# Altium project pay-ssm.PrjPCB (part 2 of 2)
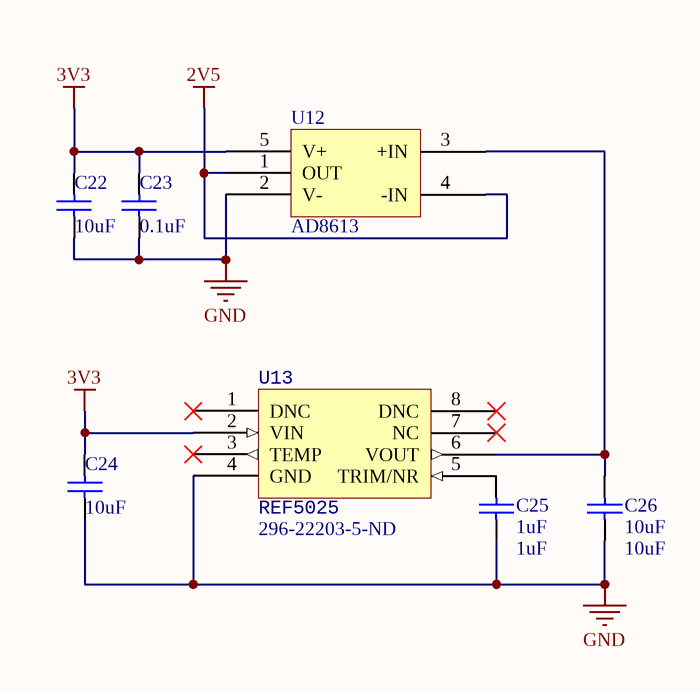
[diagram p13: power2V5.SchDoc]

## Nets that join several sheets
2V5: pay-ssm (10 pins), thermistorADC (C32.2 U17.31), power2V5 (U12.1 U12.4)
3V3: pay-ssm (5 pins), ATmega32M1 (14 pins), can_transciever (C9.2 C10.2 U4.3), sensors (9 pins), heater_control (6 pins), dac-layout (5 pins), MC2 (R20_MC2.2 R23_MC2.2), portExpander (7 pins), MC1 (R20_MC1.2 R23_MC1.2), positioningAndThermistor (C20.2 C21.2 U10.5 U11.5), thermistorADC (9 pins), sensors-digital (9 pins), microcontrollerOptical (16 pins), power2V5 (5 pins)
+5: pay-ssm (P2.4 P21.15), heater_control (11 pins), MC2 (C16_MC2.2 C17_MC2.2 U8_MC2.18 U8_MC2.19), MC1 (C16_MC1.2 C17_MC1.2 U8_MC1.18 U8_MC1.19)
GND: pay-ssm (5 pins), ATmega32M1 (13 pins), can_transciever (6 pins), sensors (8 pins), heater_control (9 pins), dac-layout (5 pins), MC2 (15 pins), portExpander (8 pins), MC1 (15 pins), positioningAndThermistor (18 pins), thermistorADC (16 pins), sensors-digital (11 pins), microcontrollerOptical (13 pins), power2V5 (7 pins)
ADC_~{CS}: ATmega32M1 (U2.27), thermistorADC (R49.1 U17.23)
CANH: pay-ssm (P2.3 P21.2), can_transciever (R15.1 U4.7)
CANL: pay-ssm (P2.2 P21.4), can_transciever (R12.1 U4.6)
CH2: pay-ssm (P3.6), positioningAndThermistor (R41.6), thermistorADC (U17.16)
CH3: pay-ssm (P3.8), positioningAndThermistor (R41.5), thermistorADC (U17.15)
CH4: pay-ssm (P3.10), positioningAndThermistor (R42.8), thermistorADC (U17.14)
CH6: pay-ssm (P4.6), positioningAndThermistor (R42.5), thermistorADC (U17.12)
CH7: pay-ssm (P4.4), positioningAndThermistor (R42.6), thermistorADC (U17.11)
CH8: pay-ssm (P4.8), positioningAndThermistor (R43.6), thermistorADC (U17.10)
CH9: pay-ssm (P4.10), positioningAndThermistor (R43.5), thermistorADC (U17.9)
CH10: positioningAndThermistor (U11.1 U11.4), thermistorADC (U17.8)
CH11: positioningAndThermistor (U10.1 U10.4), thermistorADC (U17.7)
DAC_A: pay-ssm (P21.12), heater_control (U5.4 U6.4), dac-layout (U19#1.1)
DAC_B: pay-ssm (P21.14), heater_control (U7.4), dac-layout (U19#1.2)
DAC_~{CLR}: ATmega32M1 (U2.32), dac-layout (R47.1 U19#1.5)
DAC_~{CS}: ATmega32M1 (U2.29), dac-layout (R46.1 U19#1.6)
DATA_RDY: ATmega32M1 (U2.16), sensors-digital (R53.2), microcontrollerOptical (U20.29)
DECAY: MC2 (R30_MC2.2 U8_MC2.3), portExpander (U9.23), MC1 (R30_MC1.2 U8_MC1.3)
DIR_A: portExpander (U9.24), MC1 (U8_MC1.12)
DIR_B: MC2 (U8_MC2.12), portExpander (U9.4)
~{EN}_A: portExpander (U9.26), MC1 (R23_MC1.1 U8_MC1.10)
~{EN}_B: MC2 (R23_MC2.1 U8_MC2.10), portExpander (U9.6)
~{FLT}_A: portExpander (U9.21), MC1 (R20_MC1.1 U8_MC1.16)
~{FLT}_B: MC2 (R20_MC2.1 U8_MC2.16), portExpander (U9.22)
HM_~{CS}: ATmega32M1 (U2.17), sensors (R45.1 U14.3)
INTA: ATmega32M1 (U2.26), portExpander (U9.20)
LBK: ATmega32M1 (U2.30), can_transciever (R14.2)
LED_CLK: sensors-digital (5 pins), microcontrollerOptical (P19.4 R58.1 U20.2 U21.1)
LED_PEX_~{CS}: sensors-digital (P16.6 P18.6), microcontrollerOptical (U20.32)
LED_PEX_~{RST}: sensors-digital (P16.8 P18.8), microcontrollerOptical (U20.13)
M0: MC2 (R21_MC2.2 U8_MC2.13), portExpander (U9.27), MC1 (R21_MC1.2 U8_MC1.13)
M1: MC2 (R22_MC2.2 U8_MC2.14), portExpander (U9.28), MC1 (R22_MC1.2 U8_MC1.14)
MISO: pay-ssm (P21.1), ATmega32M1 (U2.8), sensors (R55#1.2 U14.5 U15.3 U16.8), portExpander (U9.14), thermistorADC (U17.26), sensors-digital (R52.1)
MISO_32M1: sensors-digital (P16.3 P18.3 P22.1 U19#2.3), microcontrollerOptical (U20.8 U21.9)
MISO_A: sensors-digital (P22.8 R52.8), microcontrollerOptical (P19.1 U20.1)
MOSI: pay-ssm (P21.3), ATmega32M1 (U2.9), sensors (U16.7), dac-layout (U19#1.8), portExpander (U9.13), thermistorADC (U17.25), sensors-digital (R52.2)
MOSI_32M1: sensors-digital (P16.4 P18.4 P22.2 U19#2.2), microcontrollerOptical (U20.9 U21.11)
MOSI_A: pay-ssm (P2.7 P21.11), ATmega32M1 (5 pins)
PB2/INT1: sensors-digital (R54#2.2), microcontrollerOptical (U20.16)
PB4: sensors-digital (U19#2.8), microcontrollerOptical (U20.24)
PB5/INT2: sensors-digital (R54#2.3), microcontrollerOptical (U20.26)
PB6: sensors-digital (U19#2.11), microcontrollerOptical (U20.27)
PC0/INT3: sensors-digital (R54#2.4), microcontrollerOptical (U20.30)
PC2: sensors-digital (U19#2.6), microcontrollerOptical (U20.6)
PC3: sensors-digital (R55#2.1), microcontrollerOptical (U20.7)
PC4: sensors-digital (R55#2.2), microcontrollerOptical (U20.17)
PC5: sensors-digital (R55#2.3), microcontrollerOptical (U20.18)
PC6: sensors-digital (R55#2.4), microcontrollerOptical (U20.22)
PC7: sensors-digital (U19#2.13), microcontrollerOptical (U20.25)
PD6/INT0: sensors-digital (R54#2.1), microcontrollerOptical (U20.14)
PEX_~{CS}: ATmega32M1 (U2.13), portExpander (R33.1 U9.11)
PEX_~{RST}: ATmega32M1 (U2.14), portExpander (R32.1 U9.18)
POS_LED_1: pay-ssm (R1.1), portExpander (U9.2)
POS_LED_2: pay-ssm (R2.1), portExpander (U9.1)
POS_PHT_1: pay-ssm (P5.2), positioningAndThermistor (R44.1 U11.3)
POS_PHT_2: pay-ssm (P7.2), positioningAndThermistor (R40.2 U10.3)
PR_~{CS}: ATmega32M1 (U2.22), sensors (R48.2 U16.3)
~{RST}: pay-ssm (P2.5 P21.16), ATmega32M1 (R5.1 S1.5 U2.31 U3.11)
~{RST}_OPTICAL: ATmega32M1 (U2.24), sensors-digital (P22.5), microcontrollerOptical (5 pins)
RXCAN: pay-ssm (P21.8), ATmega32M1 (U2.7 U3.9), can_transciever (R11.2)
RXLIN_OPTICAL: sensors-digital (P22.10 R52.6), microcontrollerOptical (P19.3 U20.12 U21.3)
~{SLP}_A: portExpander (U9.25), MC1 (R28_MC1.2 R71_MC1.2 U8_MC1.1)
~{SLP}_B: MC2 (R28_MC2.2 R71_MC2.2 U8_MC2.1), portExpander (U9.5)
SCK: pay-ssm (P21.5), ATmega32M1 (U2.28), sensors (U14.4 U15.4 U16.1), dac-layout (U19#1.7), portExpander (U9.12), thermistorADC (U17.24), sensors-digital (R52.3)
SCK_32M1: sensors-digital (P16.5 P18.5 P22.3 U19#2.4), microcontrollerOptical (U20.28)
SCK_A: pay-ssm (P2.8 P21.13), ATmega32M1 (S1.2 U2.12)
SENS_~{CS}: ATmega32M1 (U2.23), sensors-digital (R52.4)
SENS_CLK: sensors-digital (P22.7 R52.5 U19#2.15), microcontrollerOptical (R56.1 U20.3)
SENS_MISO_A: pay-ssm (P2.6 P21.9), ATmega32M1 (P1.1 U2.1)
STATUS: pay-ssm (P21.7), ATmega32M1 (U2.15 U3.13)
STATUS_32M1: sensors-digital (P22.4), microcontrollerOptical (U20.15 U21.13)
STEP: ATmega32M1 (U2.3), MC2 (R29_MC2.2 U8_MC2.11), MC1 (R29_MC1.2 U8_MC1.11)
THM_1: pay-ssm (P3.2), heater_control (U5.3), positioningAndThermistor (R41.8), thermistorADC (U17.18)
THM_2: pay-ssm (P4.2), heater_control (U6.3), positioningAndThermistor (R42.7), thermistorADC (U17.13)
THM_3: pay-ssm (P3.4), heater_control (U7.3), positioningAndThermistor (R41.7), thermistorADC (U17.17)
THM_DIS: ATmega32M1 (U2.25), sensors (R55#1.1)
TM_~{CS}: ATmega32M1 (U2.18), sensors (R54#1.1 U15.1)
TXCAN: pay-ssm (P21.6), ATmega32M1 (U2.6 U3.5), can_transciever (R13.2)